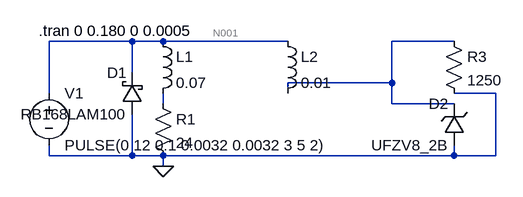
[diagram p0: schematic valve.asc]
valve.asc, the LTspice schematic file:
Version 4
SHEET 1 880 680
WIRE 128 48 0 48
WIRE 176 48 128 48
WIRE 368 48 176 48
WIRE 624 48 528 48
WIRE 128 96 128 48
WIRE 528 112 528 48
WIRE 528 112 368 112
WIRE 0 128 0 48
WIRE 368 128 368 112
WIRE 688 128 624 128
WIRE 176 144 176 128
WIRE 528 144 528 112
WIRE 624 144 528 144
WIRE 0 224 0 208
WIRE 128 224 128 160
WIRE 128 224 0 224
WIRE 176 224 128 224
WIRE 624 224 624 208
WIRE 624 224 176 224
WIRE 688 224 688 128
WIRE 688 224 624 224
WIRE 176 240 176 224
FLAG 176 240 0
SYMBOL ind 160 32 R0
SYMATTR InstName L1
SYMATTR Value 0.07
SYMBOL res 160 128 R0
SYMATTR InstName R1
SYMATTR Value 24
SYMBOL voltage 0 112 R0
WINDOW 123 0 0 Left 0
WINDOW 39 0 0 Left 0
SYMATTR InstName V1
SYMATTR Value PULSE(0 12 0.1 0.0032 0.0032 3 5 2)
SYMBOL schottky 144 160 R180
WINDOW 0 24 64 Left 2
WINDOW 3 24 0 Left 2
SYMATTR InstName D1
SYMATTR Value RB168LAM100
SYMATTR Description Diode
SYMATTR Type diode
SYMBOL zener 640 208 R180
WINDOW 0 24 64 Left 2
WINDOW 3 24 0 Left 2
SYMATTR InstName D2
SYMATTR Value UFZV8_2B
SYMATTR Description Diode
SYMATTR Type diode
SYMBOL res 608 32 R0
SYMATTR InstName R3
SYMATTR Value 1250
SYMBOL ind 352 32 R0
SYMATTR InstName L2
SYMATTR Value 0.01
TEXT -16 32 Left 2 !.tran 0 0.180 0 0.0005

The netlist it stands for:
* valve.asc
L1 N001 N003 0.07
R1 N003 0 24
V1 N001 0 PULSE(0 12 0.1 0.0032 0.0032 3 5 2)
D1 0 N001 RB168LAM100
D2 0 N002 UFZV8_2B
R3 N002 0 1250
L2 N001 N002 0.01
.model D D
.lib standard.dio
.tran 0 0.180 0 0.0005
.backanno
.end

* Results of the author's LTspice run, read from the files saved beside the schematic
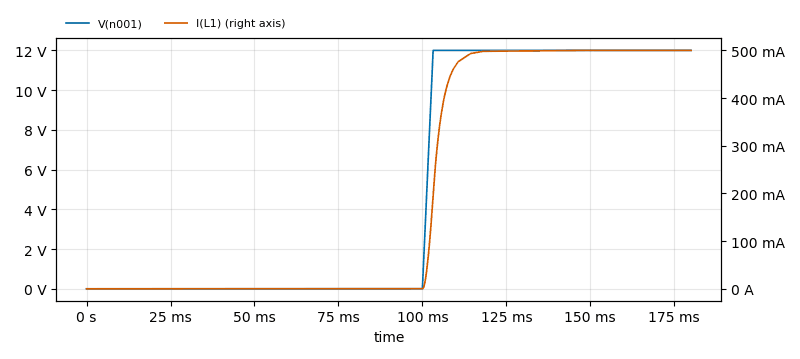
[diagram p1: Transient Analysis of valve.asc, plotted from the saved traces]
* Transient Analysis, 1 run:
*   V(n001): min 0 V, max 12 V, average 5.227 V, rms 7.893 V, last 12 V
*   I(L1): min 0 A, max 500.2 mA, average 209.5 mA, rms 320.1 mA, last 500 mA